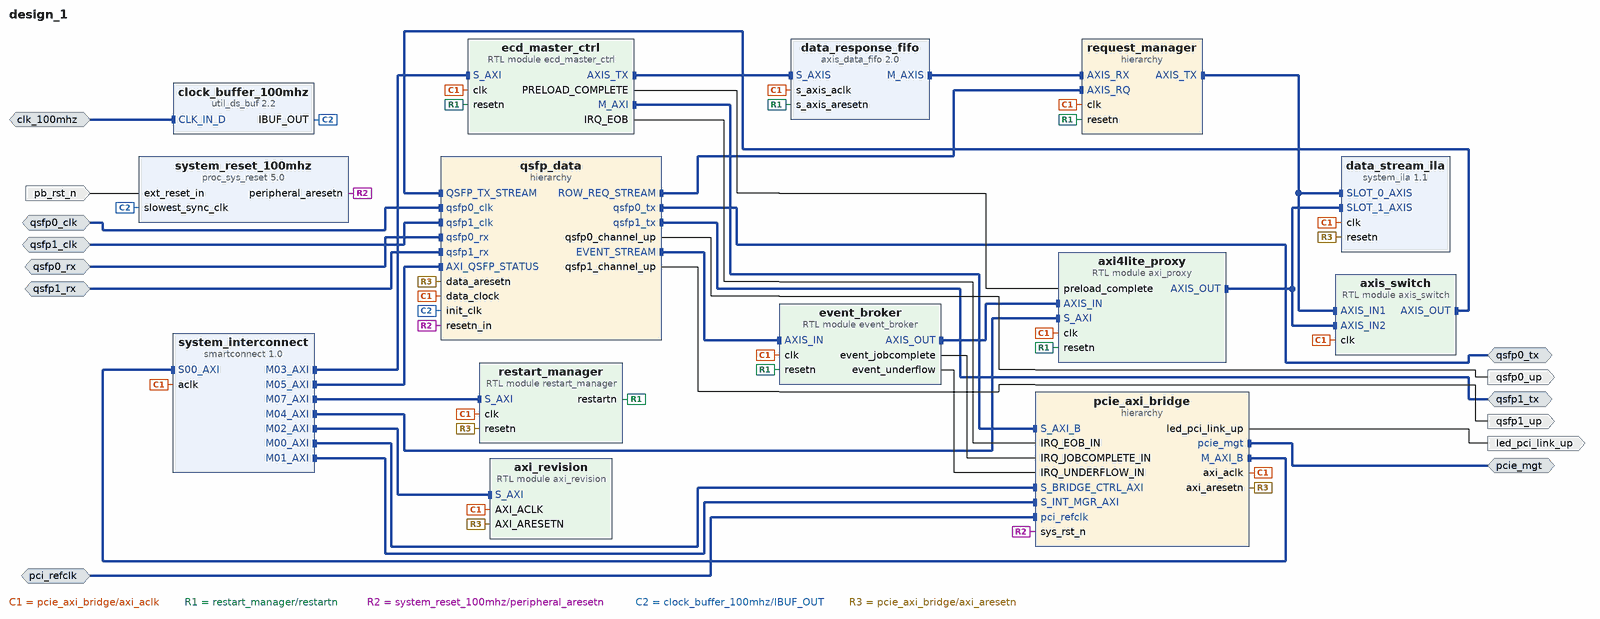
[diagram p0: block diagram of the top level]
# Vivado block design design_1, xczu19eg-ffvc1760-2-i, Vivado 2021.1
create_bd_design design_1

create_bd_intf_port -mode Slave -vlnv xilinx.com:interface:diff_clock_rtl:1.0 clk_100mhz
create_bd_intf_port -mode Slave -vlnv xilinx.com:interface:diff_clock_rtl:1.0 pci_refclk
create_bd_intf_port -mode Master -vlnv xilinx.com:interface:pcie_7x_mgt_rtl:1.0 pcie_mgt
create_bd_intf_port -mode Slave -vlnv xilinx.com:interface:diff_clock_rtl:1.0 qsfp0_clk
set_property -dict {CONFIG.FREQ_HZ 322265625} [get_bd_intf_ports qsfp0_clk]
create_bd_intf_port -mode Master -vlnv xilinx.com:display_aurora:GT_Serial_Transceiver_Pins_TX_rtl:1.0 qsfp0_tx
create_bd_intf_port -mode Slave -vlnv xilinx.com:display_aurora:GT_Serial_Transceiver_Pins_RX_rtl:1.0 qsfp0_rx
create_bd_intf_port -mode Master -vlnv xilinx.com:display_aurora:GT_Serial_Transceiver_Pins_TX_rtl:1.0 qsfp1_tx
create_bd_intf_port -mode Slave -vlnv xilinx.com:display_aurora:GT_Serial_Transceiver_Pins_RX_rtl:1.0 qsfp1_rx
create_bd_intf_port -mode Slave -vlnv xilinx.com:interface:diff_clock_rtl:1.0 qsfp1_clk
set_property -dict {CONFIG.FREQ_HZ 322265625} [get_bd_intf_ports qsfp1_clk]
create_bd_port -dir I -type rst pb_rst_n
create_bd_port -dir O led_pci_link_up
create_bd_port -dir O qsfp0_up
create_bd_port -dir O qsfp1_up

create_bd_cell -type ip -vlnv xilinx.com:ip:proc_sys_reset:5.0 system_reset_100mhz
create_bd_cell -type ip -vlnv xilinx.com:ip:util_ds_buf:2.2 clock_buffer_100mhz
create_bd_cell -type hier pcie_axi_bridge
create_bd_cell -type hier qsfp_data
create_bd_cell -type ip -vlnv xilinx.com:ip:axis_data_fifo:2.0 data_response_fifo
set_property -dict {CONFIG.FIFO_DEPTH 4096 CONFIG.IS_ACLK_ASYNC 0} [get_bd_cells data_response_fifo]
create_bd_cell -type module -reference restart_manager restart_manager
create_bd_cell -type hier request_manager
create_bd_cell -type ip -vlnv xilinx.com:ip:smartconnect:1.0 system_interconnect
set_property -dict {CONFIG.HAS_ARESETN 0 CONFIG.NUM_CLKS 1 CONFIG.NUM_MI 8 CONFIG.NUM_SI 1} [get_bd_cells system_interconnect]
create_bd_cell -type module -reference axi_revision axi_revision
create_bd_cell -type ip -vlnv xilinx.com:ip:system_ila:1.1 data_stream_ila
set_property -dict [list \
  CONFIG.C_DATA_DEPTH 4096 \
  CONFIG.C_MON_TYPE INTERFACE \
  CONFIG.C_NUM_MONITOR_SLOTS 2 \
  CONFIG.C_NUM_OF_PROBES 1 \
  CONFIG.C_PROBE0_TYPE 0 \
  CONFIG.C_PROBE1_TYPE 0 \
  CONFIG.C_PROBE2_TYPE 0 \
  CONFIG.C_PROBE3_TYPE 0 \
  CONFIG.C_SLOT_0_APC_EN 0 \
  CONFIG.C_SLOT_0_AXI_DATA_SEL 1 \
  CONFIG.C_SLOT_0_AXI_TRIG_SEL 1 \
  CONFIG.C_SLOT_0_INTF_TYPE xilinx.com:interface:axis_rtl:1.0 \
  CONFIG.C_SLOT_0_TYPE 0 \
  CONFIG.C_SLOT_1_APC_EN 0 \
  CONFIG.C_SLOT_1_AXI_AR_SEL_DATA 1 \
  CONFIG.C_SLOT_1_AXI_AR_SEL_TRIG 1 \
  CONFIG.C_SLOT_1_AXI_AW_SEL_DATA 1 \
  CONFIG.C_SLOT_1_AXI_AW_SEL_TRIG 1 \
  CONFIG.C_SLOT_1_AXI_B_SEL_DATA 1 \
  CONFIG.C_SLOT_1_AXI_B_SEL_TRIG 1 \
  CONFIG.C_SLOT_1_AXI_DATA_SEL 1 \
  CONFIG.C_SLOT_1_AXI_R_SEL_DATA 1 \
  CONFIG.C_SLOT_1_AXI_R_SEL_TRIG 1 \
  CONFIG.C_SLOT_1_AXI_TRIG_SEL 1 \
  CONFIG.C_SLOT_1_AXI_W_SEL_DATA 1 \
  CONFIG.C_SLOT_1_AXI_W_SEL_TRIG 1 \
  CONFIG.C_SLOT_1_INTF_TYPE xilinx.com:interface:axis_rtl:1.0 \
  CONFIG.C_SLOT_1_TYPE 0 \
  CONFIG.C_SLOT_2_APC_EN 0 \
  CONFIG.C_SLOT_2_AXI_DATA_SEL 1 \
  CONFIG.C_SLOT_2_AXI_TRIG_SEL 1 \
  CONFIG.C_SLOT_2_INTF_TYPE xilinx.com:interface:axis_rtl:1.0 \
  CONFIG.C_SLOT_2_TYPE 0 \
  CONFIG.C_SLOT_3_APC_EN 0 \
  CONFIG.C_SLOT_3_AXI_DATA_SEL 1 \
  CONFIG.C_SLOT_3_AXI_TRIG_SEL 1 \
  CONFIG.C_SLOT_3_INTF_TYPE xilinx.com:interface:axis_rtl:1.0 \
] [get_bd_cells data_stream_ila]
create_bd_cell -type module -reference axis_switch axis_switch
create_bd_cell -type module -reference ecd_master_ctrl ecd_master_ctrl
create_bd_cell -type module -reference axi_proxy axi4lite_proxy
create_bd_cell -type module -reference event_broker event_broker

# ---- hierarchy /pcie_axi_bridge ----
current_bd_instance /pcie_axi_bridge
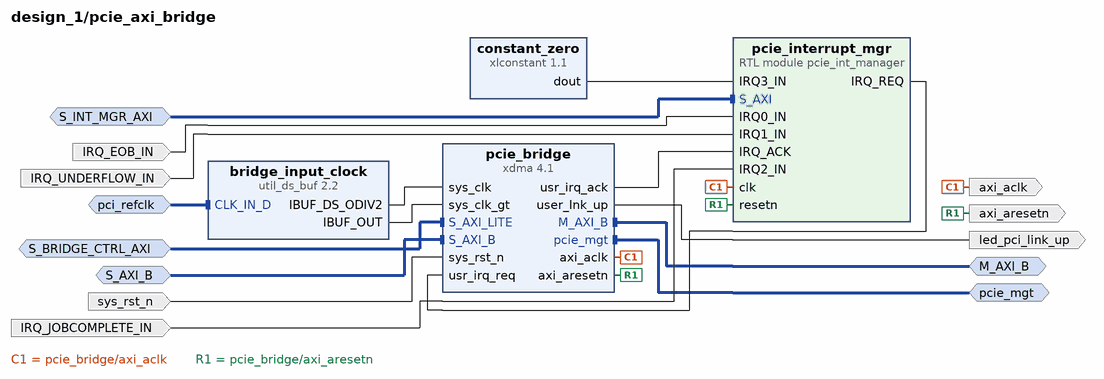
[diagram p1: block diagram inside /pcie_axi_bridge]
create_bd_intf_pin -mode Slave -vlnv xilinx.com:interface:aximm_rtl:1.0 S_BRIDGE_CTRL_AXI
create_bd_intf_pin -mode Slave -vlnv xilinx.com:interface:aximm_rtl:1.0 S_AXI_B
create_bd_intf_pin -mode Master -vlnv xilinx.com:interface:pcie_7x_mgt_rtl:1.0 pcie_mgt
create_bd_intf_pin -mode Master -vlnv xilinx.com:interface:aximm_rtl:1.0 M_AXI_B
create_bd_intf_pin -mode Slave -vlnv xilinx.com:interface:aximm_rtl:1.0 S_INT_MGR_AXI
create_bd_intf_pin -mode Slave -vlnv xilinx.com:interface:diff_clock_rtl:1.0 pci_refclk
create_bd_pin -dir O -type rst axi_aresetn
create_bd_pin -dir O -type clk axi_aclk
create_bd_pin -dir O led_pci_link_up
create_bd_pin -dir I -type rst sys_rst_n
create_bd_pin -dir I IRQ_EOB_IN
create_bd_pin -dir I IRQ_UNDERFLOW_IN
create_bd_pin -dir I IRQ_JOBCOMPLETE_IN

create_bd_cell -type ip -vlnv xilinx.com:ip:xdma:4.1 pcie_bridge
set_property -dict [list \
  CONFIG.PF0_DEVICE_ID_mqdma 903F \
  CONFIG.PF0_SRIOV_VF_DEVICE_ID A03F \
  CONFIG.PF2_DEVICE_ID_mqdma 923F \
  CONFIG.PF3_DEVICE_ID_mqdma 933F \
  CONFIG.axi_addr_width 64 \
  CONFIG.axi_data_width 512_bit \
  CONFIG.axibar2pciebar_0 0x0 \
  CONFIG.axibar_num 1 \
  CONFIG.axilite_master_en true \
  CONFIG.axilite_master_size 8 \
  CONFIG.axisten_freq 250 \
  CONFIG.bridge_burst true \
  CONFIG.c_s_axi_supports_narrow_burst false \
  CONFIG.cfg_mgmt_if false \
  CONFIG.enable_jtag_dbg true \
  CONFIG.functional_mode AXI_Bridge \
  CONFIG.mode_selection Advanced \
  CONFIG.pcie_blk_locn X1Y0 \
  CONFIG.pcie_extended_tag false \
  CONFIG.pciebar2axibar_0 0x00000000 \
  CONFIG.pciebar2axibar_1 0x800000000 \
  CONFIG.pciebar2axibar_axil_master 0A0000000 \
  CONFIG.pf0_Use_Class_Code_Lookup_Assistant false \
  CONFIG.pf0_bar0_64bit false \
  CONFIG.pf0_bar0_scale Megabytes \
  CONFIG.pf0_bar0_size 1 \
  CONFIG.pf0_bar1_enabled true \
  CONFIG.pf0_bar1_scale Megabytes \
  CONFIG.pf0_bar1_size 1 \
  CONFIG.pf0_bar2_enabled false \
  CONFIG.pf0_base_class_menu Simple_communication_controllers \
  CONFIG.pf0_class_code_base 07 \
  CONFIG.pf0_class_code_interface 01 \
  CONFIG.pf0_class_code_sub 00 \
  CONFIG.pf0_device_id 903F \
  CONFIG.pf0_interrupt_pin INTA \
  CONFIG.pf0_msi_enabled false \
  CONFIG.pf0_sub_class_interface_menu 16450_compatible_serial_controller \
  CONFIG.pf0_subsystem_id 0007 \
  CONFIG.pl_link_cap_max_link_speed 8.0_GT/s \
  CONFIG.pl_link_cap_max_link_width X16 \
  CONFIG.plltype QPLL1 \
  CONFIG.xdma_num_usr_irq 1 \
  CONFIG.xdma_sts_ports false \
  CONFIG.xdma_wnum_rids 32 \
] [get_bd_cells pcie_bridge]
create_bd_cell -type ip -vlnv xilinx.com:ip:xlconstant:1.1 constant_zero
set_property -dict {CONFIG.CONST_VAL 0 CONFIG.CONST_WIDTH 1} [get_bd_cells constant_zero]
create_bd_cell -type ip -vlnv xilinx.com:ip:util_ds_buf:2.2 bridge_input_clock
set_property -dict {CONFIG.C_BUF_TYPE IBUFDSGTE} [get_bd_cells bridge_input_clock]
create_bd_cell -type module -reference pcie_int_manager pcie_interrupt_mgr

# ---- hierarchy /qsfp_data ----
current_bd_instance /qsfp_data
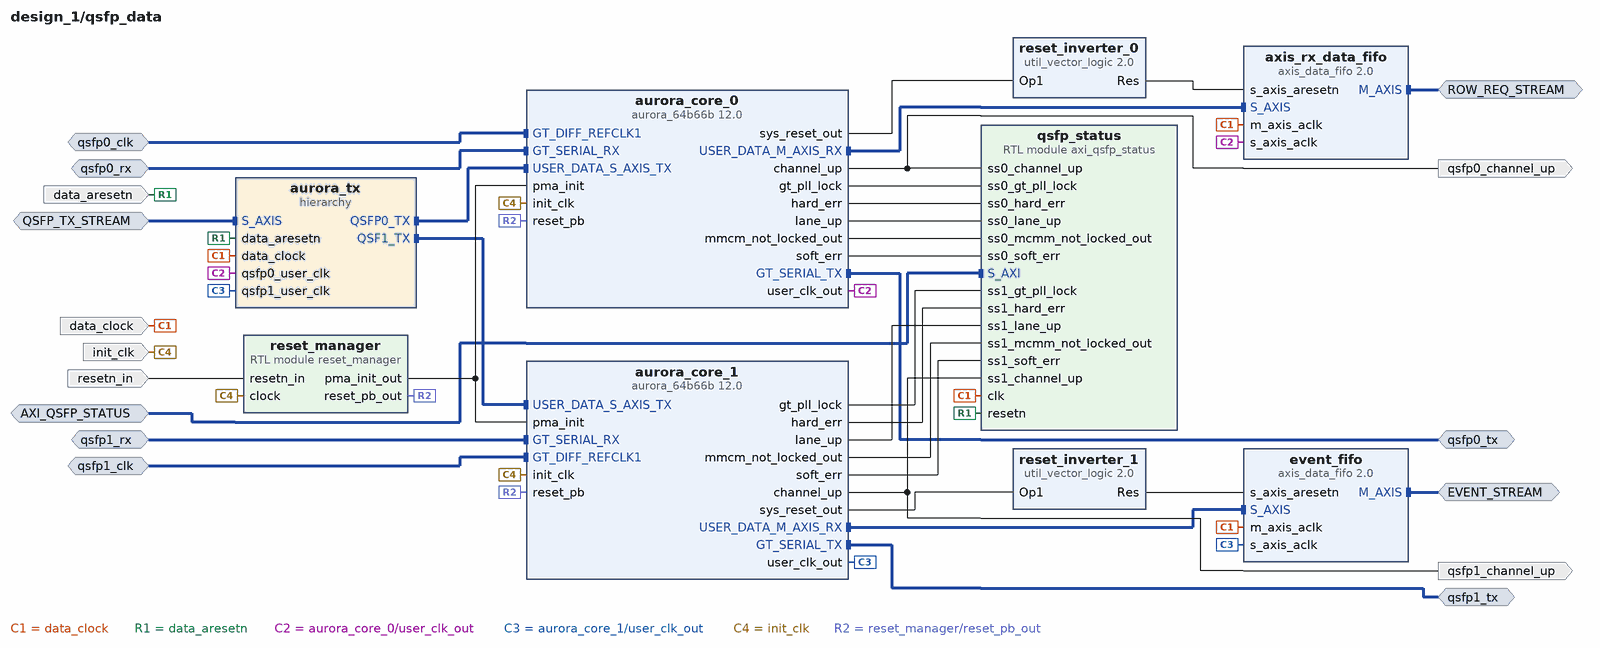
[diagram p2: block diagram inside /qsfp_data]
create_bd_intf_pin -mode Slave -vlnv xilinx.com:interface:diff_clock_rtl:1.0 qsfp0_clk
create_bd_intf_pin -mode Master -vlnv xilinx.com:display_aurora:GT_Serial_Transceiver_Pins_TX_rtl:1.0 qsfp0_tx
create_bd_intf_pin -mode Slave -vlnv xilinx.com:display_aurora:GT_Serial_Transceiver_Pins_RX_rtl:1.0 qsfp0_rx
create_bd_intf_pin -mode Master -vlnv xilinx.com:display_aurora:GT_Serial_Transceiver_Pins_TX_rtl:1.0 qsfp1_tx
create_bd_intf_pin -mode Slave -vlnv xilinx.com:display_aurora:GT_Serial_Transceiver_Pins_RX_rtl:1.0 qsfp1_rx
create_bd_intf_pin -mode Slave -vlnv xilinx.com:interface:diff_clock_rtl:1.0 qsfp1_clk
create_bd_intf_pin -mode Master -vlnv xilinx.com:interface:axis_rtl:1.0 ROW_REQ_STREAM
create_bd_intf_pin -mode Slave -vlnv xilinx.com:interface:axis_rtl:1.0 QSFP_TX_STREAM
create_bd_intf_pin -mode Slave -vlnv xilinx.com:interface:aximm_rtl:1.0 AXI_QSFP_STATUS
create_bd_intf_pin -mode Master -vlnv xilinx.com:interface:axis_rtl:1.0 EVENT_STREAM
create_bd_pin -dir I -type clk init_clk
create_bd_pin -dir I -type rst resetn_in
create_bd_pin -dir O qsfp0_channel_up
create_bd_pin -dir O qsfp1_channel_up
create_bd_pin -dir I -type clk data_clock
create_bd_pin -dir I -type rst data_aresetn

create_bd_cell -type ip -vlnv xilinx.com:ip:aurora_64b66b:12.0 aurora_core_0
set_property -dict [list \
  CONFIG.CHANNEL_ENABLE {X0Y12 X0Y13 X0Y14 X0Y15} \
  CONFIG.C_AURORA_LANES 4 \
  CONFIG.C_GT_CLOCK_1 GTYQ0 \
  CONFIG.C_GT_TYPE GTY \
  CONFIG.C_LINE_RATE 25.78125 \
  CONFIG.C_REFCLK_FREQUENCY 322.265625 \
  CONFIG.C_REFCLK_SOURCE MGTREFCLK0_of_Quad_X0Y3 \
  CONFIG.C_START_LANE X0Y12 \
  CONFIG.C_START_QUAD Quad_X0Y3 \
  CONFIG.C_UCOLUMN_USED left \
  CONFIG.SupportLevel 1 \
  CONFIG.drp_mode Disabled \
  CONFIG.interface_mode Streaming \
] [get_bd_cells aurora_core_0]
create_bd_cell -type ip -vlnv xilinx.com:ip:util_vector_logic:2.0 reset_inverter_0
set_property -dict {CONFIG.C_OPERATION not CONFIG.C_SIZE 1} [get_bd_cells reset_inverter_0]
create_bd_cell -type module -reference reset_manager reset_manager
create_bd_cell -type ip -vlnv xilinx.com:ip:aurora_64b66b:12.0 aurora_core_1
set_property -dict [list \
  CONFIG.CHANNEL_ENABLE {X0Y16 X0Y17 X0Y18 X0Y19} \
  CONFIG.C_AURORA_LANES 4 \
  CONFIG.C_GT_CLOCK_1 GTYQ0 \
  CONFIG.C_GT_TYPE GTY \
  CONFIG.C_LINE_RATE 25.78125 \
  CONFIG.C_REFCLK_FREQUENCY 322.265625 \
  CONFIG.C_REFCLK_SOURCE MGTREFCLK0_of_Quad_X0Y4 \
  CONFIG.C_START_LANE X0Y16 \
  CONFIG.C_START_QUAD Quad_X0Y4 \
  CONFIG.C_UCOLUMN_USED left \
  CONFIG.SupportLevel 1 \
  CONFIG.drp_mode Disabled \
  CONFIG.interface_mode Streaming \
] [get_bd_cells aurora_core_1]
create_bd_cell -type hier aurora_tx
create_bd_cell -type ip -vlnv xilinx.com:ip:axis_data_fifo:2.0 axis_rx_data_fifo
set_property -dict {CONFIG.IS_ACLK_ASYNC 1} [get_bd_cells axis_rx_data_fifo]
create_bd_cell -type module -reference axi_qsfp_status qsfp_status
create_bd_cell -type ip -vlnv xilinx.com:ip:util_vector_logic:2.0 reset_inverter_1
set_property -dict {CONFIG.C_OPERATION not CONFIG.C_SIZE 1} [get_bd_cells reset_inverter_1]
create_bd_cell -type ip -vlnv xilinx.com:ip:axis_data_fifo:2.0 event_fifo
set_property -dict {CONFIG.FIFO_DEPTH 16 CONFIG.IS_ACLK_ASYNC 1} [get_bd_cells event_fifo]

# ---- hierarchy /qsfp_data/aurora_tx ----
current_bd_instance /qsfp_data/aurora_tx
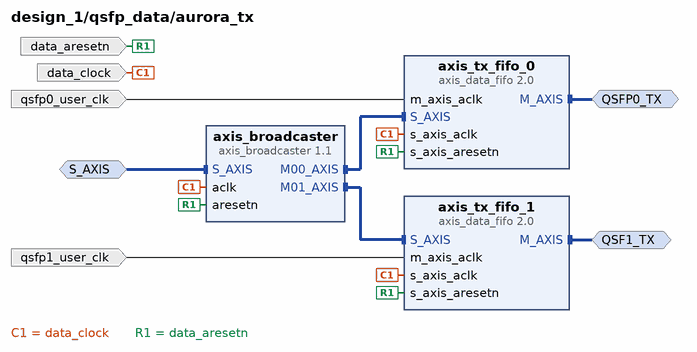
[diagram p3: block diagram inside /qsfp_data/aurora_tx]
create_bd_intf_pin -mode Master -vlnv xilinx.com:interface:axis_rtl:1.0 QSFP0_TX
create_bd_intf_pin -mode Master -vlnv xilinx.com:interface:axis_rtl:1.0 QSF1_TX
create_bd_intf_pin -mode Slave -vlnv xilinx.com:interface:axis_rtl:1.0 S_AXIS
create_bd_pin -dir I -type clk qsfp1_user_clk
create_bd_pin -dir I -type clk data_clock
create_bd_pin -dir I -type clk qsfp0_user_clk
create_bd_pin -dir I -type rst data_aresetn

create_bd_cell -type ip -vlnv xilinx.com:ip:axis_broadcaster:1.1 axis_broadcaster
set_property -dict [list \
  CONFIG.M00_TDATA_REMAP {tdata[511:256]} \
  CONFIG.M01_TDATA_REMAP {tdata[255:0]} \
  CONFIG.M_TDATA_NUM_BYTES 32 \
  CONFIG.S_TDATA_NUM_BYTES 64 \
] [get_bd_cells axis_broadcaster]
create_bd_cell -type ip -vlnv xilinx.com:ip:axis_data_fifo:2.0 axis_tx_fifo_0
set_property -dict {CONFIG.IS_ACLK_ASYNC 1} [get_bd_cells axis_tx_fifo_0]
create_bd_cell -type ip -vlnv xilinx.com:ip:axis_data_fifo:2.0 axis_tx_fifo_1
set_property -dict {CONFIG.IS_ACLK_ASYNC 1} [get_bd_cells axis_tx_fifo_1]

# ---- hierarchy /request_manager ----
current_bd_instance /request_manager
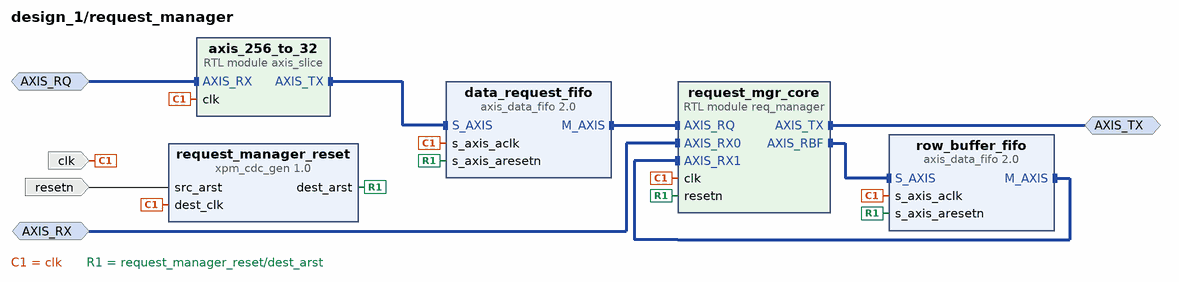
[diagram p4: block diagram inside /request_manager]
create_bd_intf_pin -mode Slave -vlnv xilinx.com:interface:axis_rtl:1.0 AXIS_RX
create_bd_intf_pin -mode Master -vlnv xilinx.com:interface:axis_rtl:1.0 AXIS_TX
create_bd_intf_pin -mode Slave -vlnv xilinx.com:interface:axis_rtl:1.0 AXIS_RQ
create_bd_pin -dir I -type clk clk
create_bd_pin -dir I resetn

create_bd_cell -type ip -vlnv xilinx.com:ip:axis_data_fifo:2.0 data_request_fifo
set_property -dict {CONFIG.FIFO_DEPTH 64} [get_bd_cells data_request_fifo]
create_bd_cell -type module -reference axis_slice axis_256_to_32
create_bd_cell -type ip -vlnv xilinx.com:ip:xpm_cdc_gen:1.0 request_manager_reset
set_property -dict {CONFIG.CDC_TYPE xpm_cdc_async_rst CONFIG.WIDTH 1} [get_bd_cells request_manager_reset]
create_bd_cell -type ip -vlnv xilinx.com:ip:axis_data_fifo:2.0 row_buffer_fifo
set_property -dict {CONFIG.FIFO_DEPTH 64} [get_bd_cells row_buffer_fifo]
create_bd_cell -type module -reference req_manager request_mgr_core

# ---- connections ----

current_bd_instance /pcie_axi_bridge
connect_bd_intf_net [get_bd_intf_pins S_BRIDGE_CTRL_AXI] [get_bd_intf_pins pcie_bridge/S_AXI_LITE]
connect_bd_intf_net [get_bd_intf_pins S_AXI_B] [get_bd_intf_pins pcie_bridge/S_AXI_B]
connect_bd_intf_net [get_bd_intf_pins pcie_mgt] [get_bd_intf_pins pcie_bridge/pcie_mgt]
connect_bd_intf_net [get_bd_intf_pins M_AXI_B] [get_bd_intf_pins pcie_bridge/M_AXI_B]
connect_bd_intf_net [get_bd_intf_pins S_INT_MGR_AXI] [get_bd_intf_pins pcie_interrupt_mgr/S_AXI]
connect_bd_intf_net [get_bd_intf_pins pci_refclk] [get_bd_intf_pins bridge_input_clock/CLK_IN_D]
connect_bd_net -net IRQ0_IN_1 [get_bd_pins IRQ_EOB_IN] [get_bd_pins pcie_interrupt_mgr/IRQ0_IN]
connect_bd_net -net IRQ1_IN_1 [get_bd_pins constant_zero/dout] [get_bd_pins pcie_interrupt_mgr/IRQ3_IN]
connect_bd_net -net IRQ1_IN_2 [get_bd_pins IRQ_UNDERFLOW_IN] [get_bd_pins pcie_interrupt_mgr/IRQ1_IN]
connect_bd_net -net IRQ2_IN_1 [get_bd_pins IRQ_JOBCOMPLETE_IN] [get_bd_pins pcie_interrupt_mgr/IRQ2_IN]
connect_bd_net [get_bd_pins bridge_input_clock/IBUF_DS_ODIV2] [get_bd_pins pcie_bridge/sys_clk]
connect_bd_net [get_bd_pins bridge_input_clock/IBUF_OUT] [get_bd_pins pcie_bridge/sys_clk_gt]
connect_bd_net [get_bd_pins pcie_bridge/axi_aclk] [get_bd_pins axi_aclk] [get_bd_pins pcie_interrupt_mgr/clk]
connect_bd_net [get_bd_pins pcie_bridge/axi_aresetn] [get_bd_pins axi_aresetn] [get_bd_pins pcie_interrupt_mgr/resetn]
connect_bd_net [get_bd_pins pcie_bridge/user_lnk_up] [get_bd_pins led_pci_link_up]
connect_bd_net [get_bd_pins pcie_bridge/usr_irq_ack] [get_bd_pins pcie_interrupt_mgr/IRQ_ACK]
connect_bd_net [get_bd_pins pcie_interrupt_mgr/IRQ_REQ] [get_bd_pins pcie_bridge/usr_irq_req]
connect_bd_net [get_bd_pins sys_rst_n] [get_bd_pins pcie_bridge/sys_rst_n]

current_bd_instance /qsfp_data
connect_bd_intf_net [get_bd_intf_pins ROW_REQ_STREAM] [get_bd_intf_pins axis_rx_data_fifo/M_AXIS]
connect_bd_intf_net [get_bd_intf_pins QSFP_TX_STREAM] [get_bd_intf_pins aurora_tx/S_AXIS]
connect_bd_intf_net [get_bd_intf_pins qsfp1_tx] [get_bd_intf_pins aurora_core_1/GT_SERIAL_TX]
connect_bd_intf_net [get_bd_intf_pins qsfp1_rx] [get_bd_intf_pins aurora_core_1/GT_SERIAL_RX]
connect_bd_intf_net [get_bd_intf_pins qsfp1_clk] [get_bd_intf_pins aurora_core_1/GT_DIFF_REFCLK1]
connect_bd_intf_net [get_bd_intf_pins AXI_QSFP_STATUS] [get_bd_intf_pins qsfp_status/S_AXI]
connect_bd_intf_net -intf_net GT_DIFF_REFCLK1_0_1 [get_bd_intf_pins qsfp0_clk] [get_bd_intf_pins aurora_core_0/GT_DIFF_REFCLK1]
connect_bd_intf_net -intf_net GT_SERIAL_RX_0_1 [get_bd_intf_pins qsfp0_rx] [get_bd_intf_pins aurora_core_0/GT_SERIAL_RX]
connect_bd_intf_net -intf_net aurora_64b66b_0_GT_SERIAL_TX [get_bd_intf_pins qsfp0_tx] [get_bd_intf_pins aurora_core_0/GT_SERIAL_TX]
connect_bd_intf_net [get_bd_intf_pins aurora_core_0/USER_DATA_M_AXIS_RX] [get_bd_intf_pins axis_rx_data_fifo/S_AXIS]
connect_bd_intf_net [get_bd_intf_pins event_fifo/S_AXIS] [get_bd_intf_pins aurora_core_1/USER_DATA_M_AXIS_RX]
connect_bd_intf_net -intf_net aurora_tx_M_AXIS [get_bd_intf_pins aurora_core_0/USER_DATA_S_AXIS_TX] [get_bd_intf_pins aurora_tx/QSFP0_TX]
connect_bd_intf_net -intf_net aurora_tx_M_AXIS1 [get_bd_intf_pins aurora_core_1/USER_DATA_S_AXIS_TX] [get_bd_intf_pins aurora_tx/QSF1_TX]
connect_bd_intf_net -intf_net axis_data_fifo_0_M_AXIS [get_bd_intf_pins EVENT_STREAM] [get_bd_intf_pins event_fifo/M_AXIS]
connect_bd_net -net aclk_1 [get_bd_pins data_clock] \
  [get_bd_pins aurora_tx/data_clock] [get_bd_pins axis_rx_data_fifo/m_axis_aclk] [get_bd_pins qsfp_status/clk] \
  [get_bd_pins event_fifo/m_axis_aclk]
connect_bd_net -net aresetn_1 [get_bd_pins data_aresetn] [get_bd_pins aurora_tx/data_aresetn] [get_bd_pins qsfp_status/resetn]
connect_bd_net -net aurora_64b66b_0_channel_up [get_bd_pins aurora_core_0/channel_up] \
  [get_bd_pins qsfp0_channel_up] [get_bd_pins qsfp_status/ss0_channel_up]
connect_bd_net -net aurora_64b66b_0_sys_reset_out [get_bd_pins aurora_core_0/sys_reset_out] [get_bd_pins reset_inverter_0/Op1]
connect_bd_net -net aurora_64b66b_0_user_clk_out [get_bd_pins aurora_core_0/user_clk_out] \
  [get_bd_pins aurora_tx/qsfp0_user_clk] [get_bd_pins axis_rx_data_fifo/s_axis_aclk]
connect_bd_net [get_bd_pins aurora_core_0/gt_pll_lock] [get_bd_pins qsfp_status/ss0_gt_pll_lock]
connect_bd_net [get_bd_pins aurora_core_0/hard_err] [get_bd_pins qsfp_status/ss0_hard_err]
connect_bd_net [get_bd_pins aurora_core_0/lane_up] [get_bd_pins qsfp_status/ss0_lane_up]
connect_bd_net [get_bd_pins aurora_core_0/mmcm_not_locked_out] [get_bd_pins qsfp_status/ss0_mcmm_not_locked_out]
connect_bd_net [get_bd_pins aurora_core_0/soft_err] [get_bd_pins qsfp_status/ss0_soft_err]
connect_bd_net [get_bd_pins aurora_core_1/channel_up] [get_bd_pins qsfp1_channel_up] [get_bd_pins qsfp_status/ss1_channel_up]
connect_bd_net [get_bd_pins aurora_core_1/gt_pll_lock] [get_bd_pins qsfp_status/ss1_gt_pll_lock]
connect_bd_net [get_bd_pins aurora_core_1/hard_err] [get_bd_pins qsfp_status/ss1_hard_err]
connect_bd_net [get_bd_pins aurora_core_1/lane_up] [get_bd_pins qsfp_status/ss1_lane_up]
connect_bd_net [get_bd_pins aurora_core_1/mmcm_not_locked_out] [get_bd_pins qsfp_status/ss1_mcmm_not_locked_out]
connect_bd_net [get_bd_pins aurora_core_1/soft_err] [get_bd_pins qsfp_status/ss1_soft_err]
connect_bd_net [get_bd_pins aurora_core_1/sys_reset_out] [get_bd_pins reset_inverter_1/Op1]
connect_bd_net [get_bd_pins aurora_core_1/user_clk_out] [get_bd_pins aurora_tx/qsfp1_user_clk] [get_bd_pins event_fifo/s_axis_aclk]
connect_bd_net -net clock_1 [get_bd_pins init_clk] \
  [get_bd_pins aurora_core_0/init_clk] [get_bd_pins reset_manager/clock] [get_bd_pins aurora_core_1/init_clk]
connect_bd_net -net reset_in_1 [get_bd_pins resetn_in] [get_bd_pins reset_manager/resetn_in]
connect_bd_net [get_bd_pins reset_inverter_0/Res] [get_bd_pins axis_rx_data_fifo/s_axis_aresetn]
connect_bd_net [get_bd_pins reset_inverter_1/Res] [get_bd_pins event_fifo/s_axis_aresetn]
connect_bd_net [get_bd_pins reset_manager/pma_init_out] [get_bd_pins aurora_core_0/pma_init] [get_bd_pins aurora_core_1/pma_init]
connect_bd_net [get_bd_pins reset_manager/reset_pb_out] [get_bd_pins aurora_core_0/reset_pb] [get_bd_pins aurora_core_1/reset_pb]

current_bd_instance /qsfp_data/aurora_tx
connect_bd_intf_net [get_bd_intf_pins QSFP0_TX] [get_bd_intf_pins axis_tx_fifo_0/M_AXIS]
connect_bd_intf_net [get_bd_intf_pins QSF1_TX] [get_bd_intf_pins axis_tx_fifo_1/M_AXIS]
connect_bd_intf_net [get_bd_intf_pins S_AXIS] [get_bd_intf_pins axis_broadcaster/S_AXIS]
connect_bd_intf_net [get_bd_intf_pins axis_broadcaster/M00_AXIS] [get_bd_intf_pins axis_tx_fifo_0/S_AXIS]
connect_bd_intf_net [get_bd_intf_pins axis_broadcaster/M01_AXIS] [get_bd_intf_pins axis_tx_fifo_1/S_AXIS]
connect_bd_net -net aclk_1 [get_bd_pins data_clock] \
  [get_bd_pins axis_broadcaster/aclk] [get_bd_pins axis_tx_fifo_0/s_axis_aclk] [get_bd_pins axis_tx_fifo_1/s_axis_aclk]
connect_bd_net -net aresetn_1 [get_bd_pins data_aresetn] \
  [get_bd_pins axis_broadcaster/aresetn] [get_bd_pins axis_tx_fifo_1/s_axis_aresetn] \
  [get_bd_pins axis_tx_fifo_0/s_axis_aresetn]
connect_bd_net -net m_axis_aclk_1 [get_bd_pins qsfp1_user_clk] [get_bd_pins axis_tx_fifo_1/m_axis_aclk]
connect_bd_net -net user_clk_out_1 [get_bd_pins qsfp0_user_clk] [get_bd_pins axis_tx_fifo_0/m_axis_aclk]

current_bd_instance /request_manager
connect_bd_intf_net [get_bd_intf_pins AXIS_RQ] [get_bd_intf_pins axis_256_to_32/AXIS_RX]
connect_bd_intf_net [get_bd_intf_pins data_request_fifo/S_AXIS] [get_bd_intf_pins axis_256_to_32/AXIS_TX]
connect_bd_intf_net [get_bd_intf_pins request_mgr_core/AXIS_RQ] [get_bd_intf_pins data_request_fifo/M_AXIS]
connect_bd_intf_net -intf_net data_response_fifo_M_AXIS [get_bd_intf_pins AXIS_RX] [get_bd_intf_pins request_mgr_core/AXIS_RX0]
connect_bd_intf_net -intf_net request_manager_AXIS_TX [get_bd_intf_pins AXIS_TX] [get_bd_intf_pins request_mgr_core/AXIS_TX]
connect_bd_intf_net [get_bd_intf_pins request_mgr_core/AXIS_RBF] [get_bd_intf_pins row_buffer_fifo/S_AXIS]
connect_bd_intf_net [get_bd_intf_pins row_buffer_fifo/M_AXIS] [get_bd_intf_pins request_mgr_core/AXIS_RX1]
connect_bd_net -net qsfp_data_user_clk_out [get_bd_pins clk] \
  [get_bd_pins data_request_fifo/s_axis_aclk] [get_bd_pins axis_256_to_32/clk] [get_bd_pins request_manager_reset/dest_clk] \
  [get_bd_pins row_buffer_fifo/s_axis_aclk] [get_bd_pins request_mgr_core/clk]
connect_bd_net [get_bd_pins request_manager_reset/dest_arst] \
  [get_bd_pins data_request_fifo/s_axis_aresetn] [get_bd_pins row_buffer_fifo/s_axis_aresetn] \
  [get_bd_pins request_mgr_core/resetn]
connect_bd_net -net src_arst_1 [get_bd_pins resetn] [get_bd_pins request_manager_reset/src_arst]
set_property HDL_ATTRIBUTE.DEBUG true [get_bd_intf_nets request_manager_AXIS_TX]

current_bd_instance /
connect_bd_intf_net [get_bd_intf_pins request_manager/AXIS_RQ] [get_bd_intf_pins qsfp_data/ROW_REQ_STREAM]
connect_bd_intf_net -intf_net CLK_IN_D_0_1 [get_bd_intf_ports clk_100mhz] [get_bd_intf_pins clock_buffer_100mhz/CLK_IN_D]
connect_bd_intf_net -intf_net GT_DIFF_REFCLK1_0_1 [get_bd_intf_ports qsfp0_clk] [get_bd_intf_pins qsfp_data/qsfp0_clk]
connect_bd_intf_net -intf_net GT_DIFF_REFCLK1_0_3 [get_bd_intf_ports qsfp1_clk] [get_bd_intf_pins qsfp_data/qsfp1_clk]
connect_bd_intf_net -intf_net GT_SERIAL_RX_0_1 [get_bd_intf_ports qsfp0_rx] [get_bd_intf_pins qsfp_data/qsfp0_rx]
connect_bd_intf_net -intf_net GT_SERIAL_RX_0_3 [get_bd_intf_ports qsfp1_rx] [get_bd_intf_pins qsfp_data/qsfp1_rx]
connect_bd_intf_net -intf_net aurora_64b66b_0_GT_SERIAL_TX [get_bd_intf_ports qsfp0_tx] [get_bd_intf_pins qsfp_data/qsfp0_tx]
connect_bd_intf_net -intf_net axi_proxy_AXIS [get_bd_intf_pins axi4lite_proxy/AXIS_OUT] [get_bd_intf_pins axis_switch/AXIS_IN2]
connect_bd_intf_net [get_bd_intf_pins axi4lite_proxy/AXIS_OUT] [get_bd_intf_pins data_stream_ila/SLOT_1_AXIS]
connect_bd_intf_net -intf_net axis_switch_0_AXIS_OUT [get_bd_intf_pins axis_switch/AXIS_OUT] [get_bd_intf_pins qsfp_data/QSFP_TX_STREAM]
connect_bd_intf_net [get_bd_intf_pins data_response_fifo/M_AXIS] [get_bd_intf_pins request_manager/AXIS_RX]
connect_bd_intf_net [get_bd_intf_pins ecd_master_ctrl/AXIS_TX] [get_bd_intf_pins data_response_fifo/S_AXIS]
connect_bd_intf_net [get_bd_intf_pins ecd_master_ctrl/M_AXI] [get_bd_intf_pins pcie_axi_bridge/S_AXI_B]
connect_bd_intf_net -intf_net event_broker_0_AXIS_OUT [get_bd_intf_pins event_broker/AXIS_OUT] [get_bd_intf_pins axi4lite_proxy/AXIS_IN]
connect_bd_intf_net [get_bd_intf_ports pci_refclk] [get_bd_intf_pins pcie_axi_bridge/pci_refclk]
connect_bd_intf_net [get_bd_intf_pins pcie_axi_bridge/M_AXI_B] [get_bd_intf_pins system_interconnect/S00_AXI]
connect_bd_intf_net [get_bd_intf_ports pcie_mgt] [get_bd_intf_pins pcie_axi_bridge/pcie_mgt]
connect_bd_intf_net [get_bd_intf_pins qsfp_data/EVENT_STREAM] [get_bd_intf_pins event_broker/AXIS_IN]
connect_bd_intf_net -intf_net qsfp_data_GT_SERIAL_TX_0 [get_bd_intf_ports qsfp1_tx] [get_bd_intf_pins qsfp_data/qsfp1_tx]
connect_bd_intf_net -intf_net request_manager_AXIS_TX [get_bd_intf_pins request_manager/AXIS_TX] [get_bd_intf_pins axis_switch/AXIS_IN1]
connect_bd_intf_net [get_bd_intf_pins request_manager/AXIS_TX] [get_bd_intf_pins data_stream_ila/SLOT_0_AXIS]
connect_bd_intf_net [get_bd_intf_pins system_interconnect/M00_AXI] [get_bd_intf_pins pcie_axi_bridge/S_BRIDGE_CTRL_AXI]
connect_bd_intf_net [get_bd_intf_pins system_interconnect/M01_AXI] [get_bd_intf_pins pcie_axi_bridge/S_INT_MGR_AXI]
connect_bd_intf_net [get_bd_intf_pins axi_revision/S_AXI] [get_bd_intf_pins system_interconnect/M02_AXI]
connect_bd_intf_net [get_bd_intf_pins ecd_master_ctrl/S_AXI] [get_bd_intf_pins system_interconnect/M03_AXI]
connect_bd_intf_net [get_bd_intf_pins axi4lite_proxy/S_AXI] [get_bd_intf_pins system_interconnect/M04_AXI]
connect_bd_intf_net [get_bd_intf_pins system_interconnect/M05_AXI] [get_bd_intf_pins qsfp_data/AXI_QSFP_STATUS]
connect_bd_intf_net [get_bd_intf_pins restart_manager/S_AXI] [get_bd_intf_pins system_interconnect/M07_AXI]
connect_bd_net -net ecd_master_ctrl_IRQ_PPB0 [get_bd_pins ecd_master_ctrl/IRQ_EOB] [get_bd_pins pcie_axi_bridge/IRQ_EOB_IN]
connect_bd_net [get_bd_pins ecd_master_ctrl/PRELOAD_COMPLETE] [get_bd_pins axi4lite_proxy/preload_complete]
connect_bd_net [get_bd_pins event_broker/event_jobcomplete] [get_bd_pins pcie_axi_bridge/IRQ_JOBCOMPLETE_IN]
connect_bd_net [get_bd_pins event_broker/event_underflow] [get_bd_pins pcie_axi_bridge/IRQ_UNDERFLOW_IN]
connect_bd_net -net ext_reset_in_0_1 [get_bd_ports pb_rst_n] [get_bd_pins system_reset_100mhz/ext_reset_in]
connect_bd_net -net ila_250mhz [get_bd_pins pcie_axi_bridge/axi_aclk] \
  [get_bd_pins data_response_fifo/s_axis_aclk] [get_bd_pins restart_manager/clk] [get_bd_pins system_interconnect/aclk] \
  [get_bd_pins axi_revision/AXI_ACLK] [get_bd_pins qsfp_data/data_clock] [get_bd_pins request_manager/clk] \
  [get_bd_pins data_stream_ila/clk] [get_bd_pins axis_switch/clk] [get_bd_pins ecd_master_ctrl/clk] \
  [get_bd_pins axi4lite_proxy/clk] [get_bd_pins event_broker/clk]
connect_bd_net [get_bd_pins pcie_axi_bridge/led_pci_link_up] [get_bd_ports led_pci_link_up]
connect_bd_net -net qsfp_data_channel_up_0 [get_bd_pins qsfp_data/qsfp0_channel_up] [get_bd_ports qsfp0_up]
connect_bd_net -net qsfp_data_channel_up_1 [get_bd_pins qsfp_data/qsfp1_channel_up] [get_bd_ports qsfp1_up]
connect_bd_net -net restartn [get_bd_pins restart_manager/restartn] \
  [get_bd_pins data_response_fifo/s_axis_aresetn] [get_bd_pins request_manager/resetn] [get_bd_pins ecd_master_ctrl/resetn] \
  [get_bd_pins axi4lite_proxy/resetn] [get_bd_pins event_broker/resetn]
connect_bd_net [get_bd_pins system_reset_100mhz/peripheral_aresetn] [get_bd_pins pcie_axi_bridge/sys_rst_n] [get_bd_pins qsfp_data/resetn_in]
connect_bd_net -net util_ds_buf_0_IBUF_OUT [get_bd_pins clock_buffer_100mhz/IBUF_OUT] \
  [get_bd_pins system_reset_100mhz/slowest_sync_clk] [get_bd_pins qsfp_data/init_clk]
connect_bd_net -net xdma_0_axi_aresetn [get_bd_pins pcie_axi_bridge/axi_aresetn] \
  [get_bd_pins restart_manager/resetn] [get_bd_pins axi_revision/AXI_ARESETN] [get_bd_pins qsfp_data/data_aresetn] \
  [get_bd_pins data_stream_ila/resetn]
set_property HDL_ATTRIBUTE.DEBUG true [get_bd_intf_nets axi_proxy_AXIS]
set_property HDL_ATTRIBUTE.MARK_DEBUG true [get_bd_intf_nets axi_proxy_AXIS]
set_property HDL_ATTRIBUTE.DEBUG true [get_bd_intf_nets request_manager_AXIS_TX]
set_property HDL_ATTRIBUTE.MARK_DEBUG true [get_bd_intf_nets request_manager_AXIS_TX]

# ---- address map ----
assign_bd_address -offset 0x0000000000000000 -range 16E -target_address_space [get_bd_addr_spaces ecd_master_ctrl/M_AXI] [get_bd_addr_segs pcie_axi_bridge/pcie_bridge/S_AXI_B/BAR0]
assign_bd_address -offset 0x0000000000000000 -range 256 -target_address_space [get_bd_addr_spaces pcie_axi_bridge/pcie_bridge/M_AXI_B] [get_bd_addr_segs axi_revision/S_AXI/reg0]
assign_bd_address -offset 0x0000000000000100 -range 256 -target_address_space [get_bd_addr_spaces pcie_axi_bridge/pcie_bridge/M_AXI_B] [get_bd_addr_segs ecd_master_ctrl/S_AXI/reg0]
assign_bd_address -offset 0x0000000000000200 -range 256 -target_address_space [get_bd_addr_spaces pcie_axi_bridge/pcie_bridge/M_AXI_B] [get_bd_addr_segs pcie_axi_bridge/pcie_interrupt_mgr/S_AXI/reg0]
assign_bd_address -offset 0x0000000000000300 -range 256 -target_address_space [get_bd_addr_spaces pcie_axi_bridge/pcie_bridge/M_AXI_B] [get_bd_addr_segs restart_manager/S_AXI/reg0]
assign_bd_address -offset 0x0000000000000400 -range 256 -target_address_space [get_bd_addr_spaces pcie_axi_bridge/pcie_bridge/M_AXI_B] [get_bd_addr_segs axi4lite_proxy/S_AXI/reg0]
assign_bd_address -offset 0x0000000000000500 -range 256 -target_address_space [get_bd_addr_spaces pcie_axi_bridge/pcie_bridge/M_AXI_B] [get_bd_addr_segs qsfp_data/qsfp_status/S_AXI/reg0]
assign_bd_address -offset 0x0000000000009000 -range 4K -target_address_space [get_bd_addr_spaces pcie_axi_bridge/pcie_bridge/M_AXI_B] [get_bd_addr_segs pcie_axi_bridge/pcie_bridge/S_AXI_LITE/CTL0]

validate_bd_design
save_bd_design
